# Altium project BMW Front-Centet Driver-Passenger Light.PrjPcb
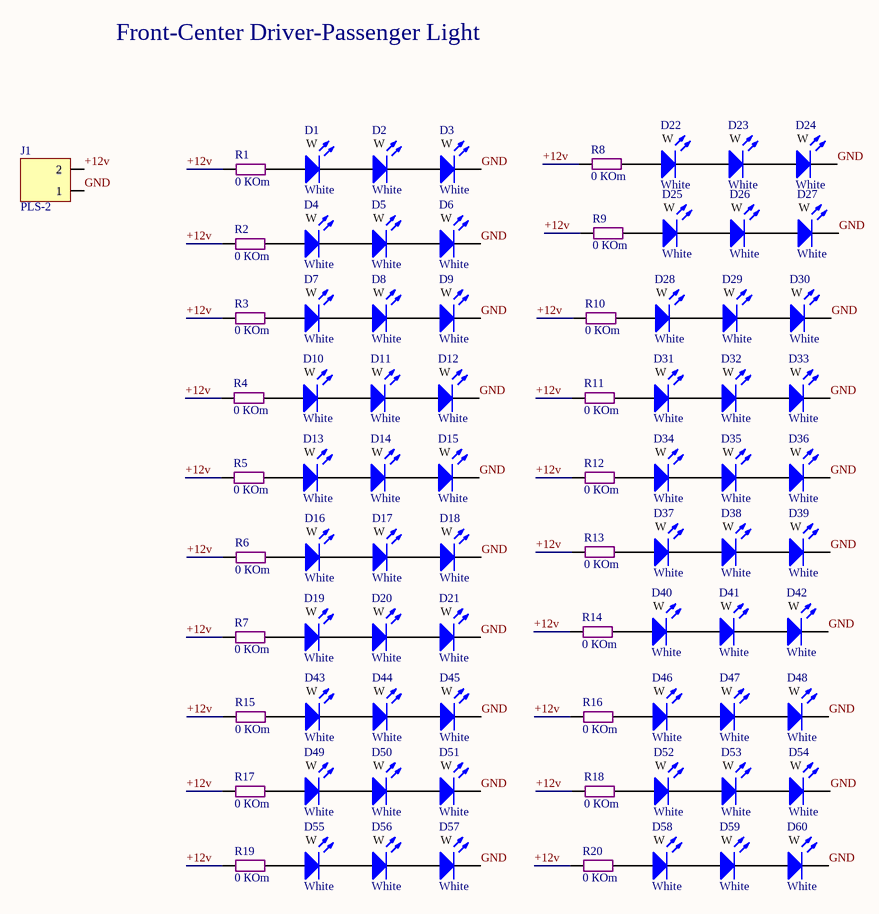
[diagram p0: BMW Front-Centet Driver-Passenger Light.SchDoc]
1 sheet, 81 parts. Net scope: global (net labels, ports and power ports of the same name join across sheets).
Board file: BMW Front-Centet Driver-Passenger Light.PcbDoc

## Sheet BMW Front-Centet Driver-Passenger Light.SchDoc
size A4

### Parts
D1  White  [LED Round 5mm White]
D2  White  [LED Round 5mm White]
D3  White  [LED Round 5mm White]
D4  White  [LED Round 5mm White]
D5  White  [LED Round 5mm White]
D6  White  [LED Round 5mm White]
D7  White  [LED Round 5mm White]
D8  White  [LED Round 5mm White]
D9  White  [LED Round 5mm White]
D10  White  [LED Round 5mm White]
D11  White  [LED Round 5mm White]
D12  White  [LED Round 5mm White]
D13  White  [LED Round 5mm White]
D14  White  [LED Round 5mm White]
D15  White  [LED Round 5mm White]
D16  White  [LED Round 5mm White]
D17  White  [LED Round 5mm White]
D18  White  [LED Round 5mm White]
D19  White  [LED Round 5mm White]
D20  White  [LED Round 5mm White]
D21  White  [LED Round 5mm White]
D22  White  [LED Round 5mm White]
D23  White  [LED Round 5mm White]
D24  White  [LED Round 5mm White]
D25  White  [LED Round 5mm White]
D26  White  [LED Round 5mm White]
D27  White  [LED Round 5mm White]
D28  White  [LED Round 5mm White]
D29  White  [LED Round 5mm White]
D30  White  [LED Round 5mm White]
D31  White  [LED Round 5mm White]
D32  White  [LED Round 5mm White]
D33  White  [LED Round 5mm White]
D34  White  [LED Round 5mm White]
D35  White  [LED Round 5mm White]
D36  White  [LED Round 5mm White]
D37  White  [LED Round 5mm White]
D38  White  [LED Round 5mm White]
D39  White  [LED Round 5mm White]
D40  White  [LED Round 5mm White]
D41  White  [LED Round 5mm White]
D42  White  [LED Round 5mm White]
D43  White  [LED Round 5mm White]
D44  White  [LED Round 5mm White]
D45  White  [LED Round 5mm White]
D46  White  [LED Round 5mm White]
D47  White  [LED Round 5mm White]
D48  White  [LED Round 5mm White]
D49  White  [LED Round 5mm White]
D50  White  [LED Round 5mm White]
D51  White  [LED Round 5mm White]
D52  White  [LED Round 5mm White]
D53  White  [LED Round 5mm White]
D54  White  [LED Round 5mm White]
D55  White  [LED Round 5mm White]
D56  White  [LED Round 5mm White]
D57  White  [LED Round 5mm White]
D58  White  [LED Round 5mm White]
D59  White  [LED Round 5mm White]
D60  White  [LED Round 5mm White]
J1  PLS-2  [Line 2.54 x 2]
R1  0 КOm  [SMD 0603 (1608)]
R2  0 КOm  [SMD 0603 (1608)]
R3  0 КOm  [SMD 0603 (1608)]
R4  0 КOm  [SMD 0603 (1608)]
R5  0 КOm  [SMD 0603 (1608)]
R6  0 КOm  [SMD 0603 (1608)]
R7  0 КOm  [SMD 0603 (1608)]
R8  0 КOm  [SMD 0603 (1608)]
R9  0 КOm  [SMD 0603 (1608)]
R10  0 КOm  [SMD 0603 (1608)]
R11  0 КOm  [SMD 0603 (1608)]
R12  0 КOm  [SMD 0603 (1608)]
R13  0 КOm  [SMD 0603 (1608)]
R14  0 КOm  [SMD 0603 (1608)]
R15  0 КOm  [SMD 0603 (1608)]
R16  0 КOm  [SMD 0603 (1608)]
R17  0 КOm  [SMD 0603 (1608)]
R18  0 КOm  [SMD 0603 (1608)]
R19  0 КOm  [SMD 0603 (1608)]
R20  0 КOm  [SMD 0603 (1608)]

### Nets
+12v: J1.2 R1.1 R2.1 R3.1 R4.1 R5.1 R6.1 R7.1 R8.1 R9.1 R10.1 R11.1 R12.1 R13.1 R14.1 R15.1 R16.1 R17.1 R18.1 R19.1 R20.1
GND: D3.K D6.K D9.K D12.K D15.K D18.K D21.K D24.K D27.K D30.K D33.K D36.K D39.K D42.K D45.K D48.K D51.K D54.K D57.K D60.K J1.1
NetD1_A: D1.A R1.2
NetD1_K: D1.K D2.A
NetD2_K: D2.K D3.A
NetD4_A: D4.A R2.2
NetD4_K: D4.K D5.A
NetD5_K: D5.K D6.A
NetD7_A: D7.A R3.2
NetD7_K: D7.K D8.A
NetD8_K: D8.K D9.A
NetD10_A: D10.A R4.2
NetD10_K: D10.K D11.A
NetD11_K: D11.K D12.A
NetD13_A: D13.A R5.2
NetD13_K: D13.K D14.A
NetD14_K: D14.K D15.A
NetD16_A: D16.A R6.2
NetD16_K: D16.K D17.A
NetD17_K: D17.K D18.A
NetD19_A: D19.A R7.2
NetD19_K: D19.K D20.A
NetD20_K: D20.K D21.A
NetD22_A: D22.A R8.2
NetD22_K: D22.K D23.A
NetD23_K: D23.K D24.A
NetD25_A: D25.A R9.2
NetD25_K: D25.K D26.A
NetD26_K: D26.K D27.A
NetD28_A: D28.A R10.2
NetD28_K: D28.K D29.A
NetD29_K: D29.K D30.A
NetD31_A: D31.A R11.2
NetD31_K: D31.K D32.A
NetD32_K: D32.K D33.A
NetD34_A: D34.A R12.2
NetD34_K: D34.K D35.A
NetD35_K: D35.K D36.A
NetD37_A: D37.A R13.2
NetD37_K: D37.K D38.A
NetD38_K: D38.K D39.A
NetD40_A: D40.A R14.2
NetD40_K: D40.K D41.A
NetD41_K: D41.K D42.A
NetD43_A: D43.A R15.2
NetD43_K: D43.K D44.A
NetD44_K: D44.K D45.A
NetD46_A: D46.A R16.2
NetD46_K: D46.K D47.A
NetD47_K: D47.K D48.A
NetD49_A: D49.A R17.2
NetD49_K: D49.K D50.A
NetD50_K: D50.K D51.A
NetD52_A: D52.A R18.2
NetD52_K: D52.K D53.A
NetD53_K: D53.K D54.A
NetD55_A: D55.A R19.2
NetD55_K: D55.K D56.A
NetD56_K: D56.K D57.A
NetD58_A: D58.A R20.2
NetD58_K: D58.K D59.A
NetD59_K: D59.K D60.A

### Notes on the sheet
- Front-Center Driver-Passenger Light
- (in symbol Led Round 5mm White) W

### Library data of the parts
D1-D60 = Led Round 5mm White: 3.2-3.4v 25mA, 16-20cd; Forward Voltage Min: 3.2; Forward Voltage TYP: 3.4; Wave len min/typ: 5000/6500; Liminous Min (mcd): 16000; Liminous Typ (mcd): 20000; Forward Amp (mA): 25; Color: White
J1 = PLS-2: Vert, Sgl line, Male
R1-R20 = Resistor